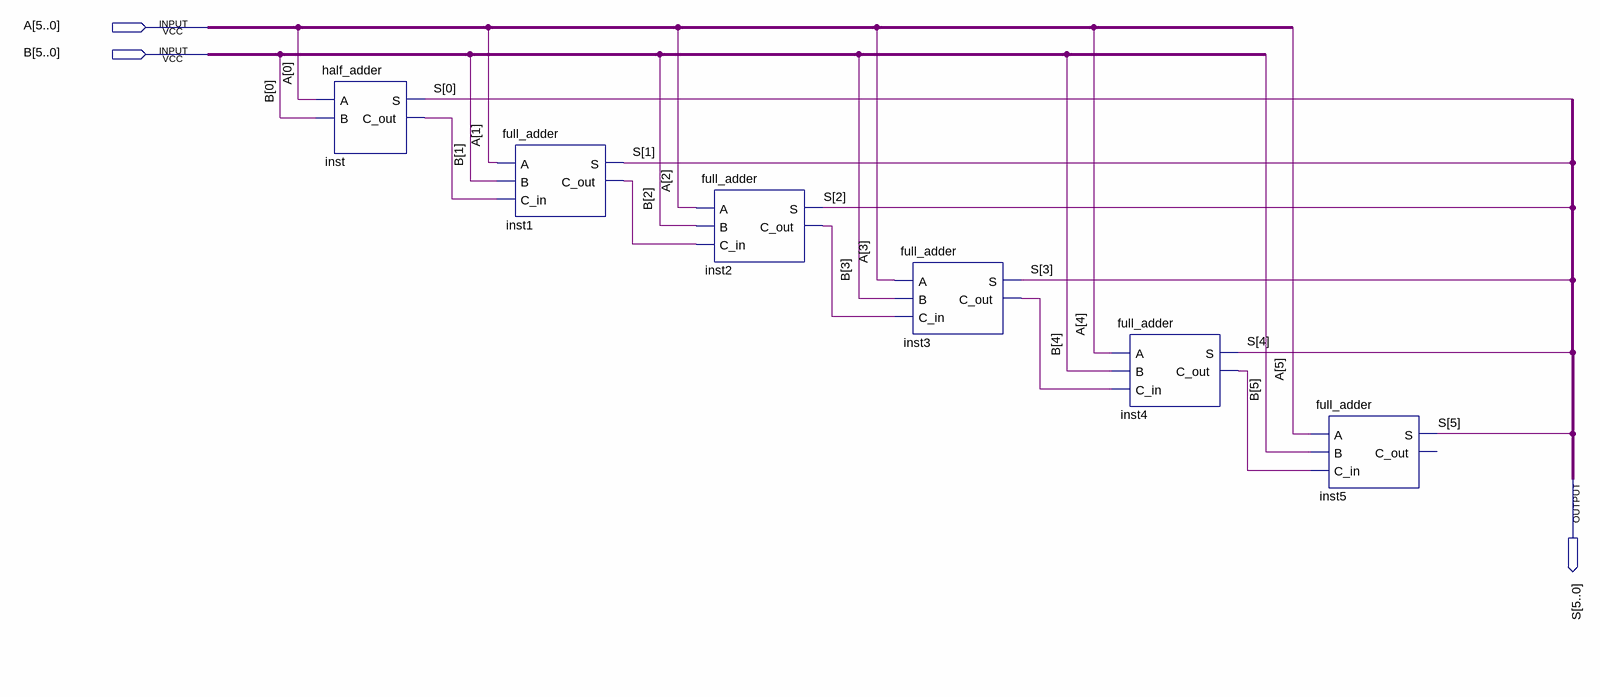
[diagram p0: schematic sheet]
// Quartus schematic adder.bdf as structural Verilog: 6 symbols, 3 pins
module adder (
  input  [5:0] A,
  input  [5:0] B,
  output [5:0] S
);

  wire inst1_c_out, inst2_c_out, inst3_c_out, inst4_c_out, inst_c_out;

  half_adder inst (.A(A[0]), .B(B[0]), .S(S[0]), .C_out(inst_c_out));
  full_adder inst1 (.A(A[1]), .B(B[1]), .C_in(inst_c_out), .S(S[1]), .C_out(inst1_c_out));
  full_adder inst2 (.A(A[2]), .B(B[2]), .C_in(inst1_c_out), .S(S[2]), .C_out(inst2_c_out));
  full_adder inst3 (.A(A[3]), .B(B[3]), .C_in(inst2_c_out), .S(S[3]), .C_out(inst3_c_out));
  full_adder inst4 (.A(A[4]), .B(B[4]), .C_in(inst3_c_out), .S(S[4]), .C_out(inst4_c_out));
  full_adder inst5 (.A(A[5]), .B(B[5]), .C_in(inst4_c_out), .S(S[5]));  // open: C_out
endmodule
